# Altium project CSI2-NITROGEN_Rev01.PrjPcb
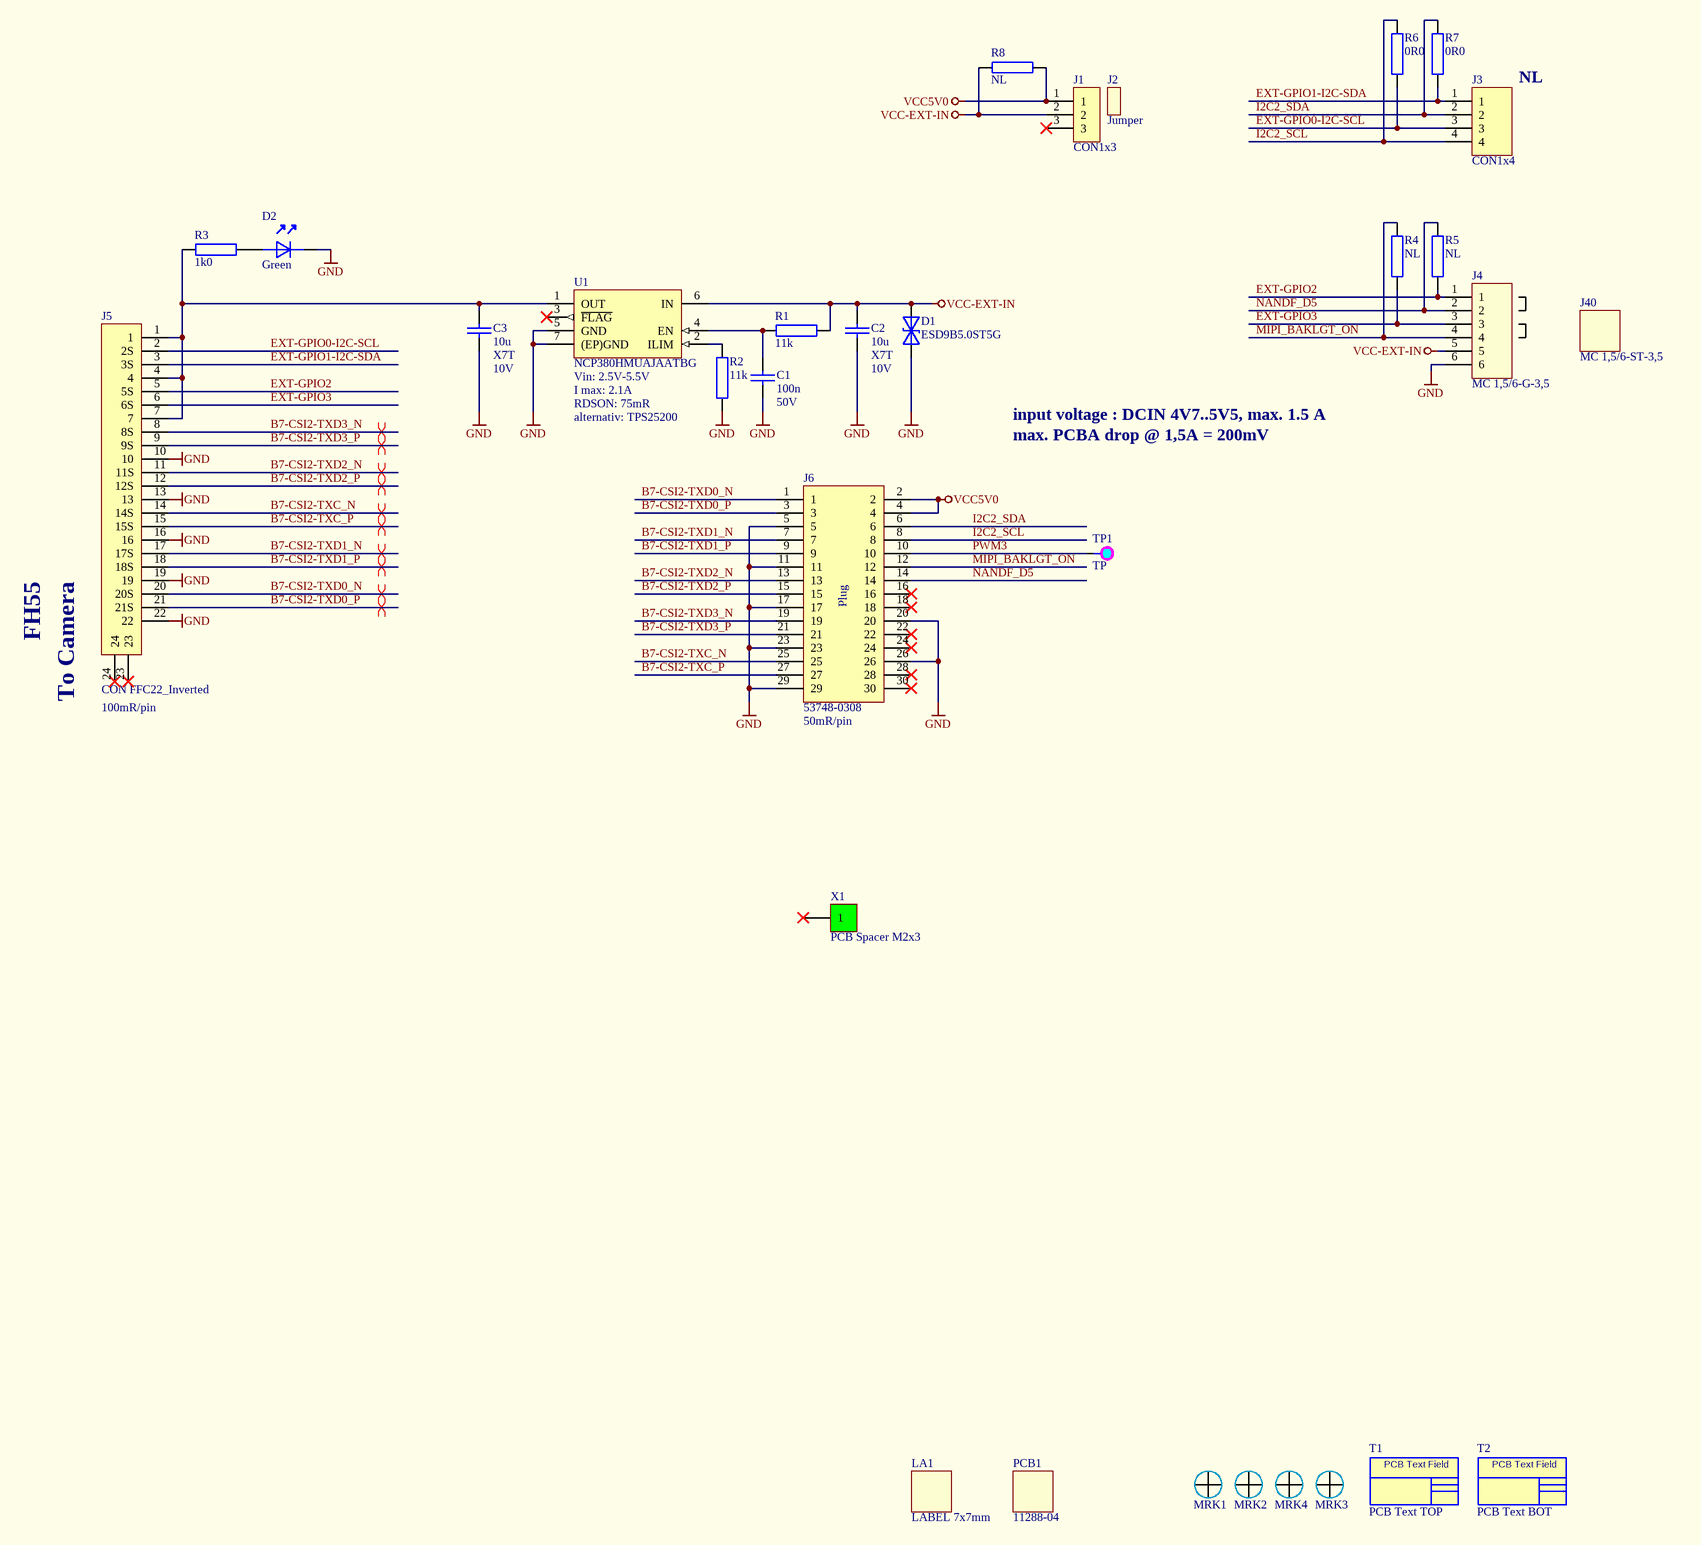
[diagram p0: CSI2-NITROGEN_Rev01.SchDoc]
VariantName: standard; Title: CSI2-NITROGEN_Rev01; RevisionPCB: 01; AuthorPCB: OFU; _ProjectName: CSI2-NITROGEN
1 sheet, 31 parts. Net scope: global (net labels, ports and power ports of the same name join across sheets).
Board file: CSI2-NITROGEN_Rev01.PcbDoc

## Sheet CSI2-NITROGEN_Rev01.SchDoc: CSI2-NITROGEN_Rev01
size A2; PageSetup: Record=PageOptions|CenterHorizontal=True|CenterVertical=True|PrintScale=0.73|XCorrection=1.00|YCorrection=1.00|PrintKind=2|BorderSize=5000000|LeftOffset=0|BottomOffset=0|Orientation=2|PaperLength=1000|PaperWidth=1000|Scale=100|PaperSource=7|PrintQuality=-4|MediaType=1|DitherType=10|PrintScaleMode=1|PaperKind=A3; CheckedBy: OFU; Author: CWA; CompanyName: Allied Vision Technologies GmbH; Address1: Taschenweg 2a; Address2: 07646 Stadtroda; Address3: Germany; Revision: 01; SheetNumber: 1; SheetTotal: 1

### Parts
C1  100n  Voltage: 50V  [C-0603_1.0]
C2  10u  Dielectric: X7T  Voltage: 10V  [C-0603_1.0]
C3  10u  Dielectric: X7T  Voltage: 10V  [C-0603_1.0]
D1  ESD9B5.0ST5G  [D-SOD923]
D2  Green  [D-0603-SLED]
J1  CON1x3  [CON 1x3 RM2.54]
J2  Jumper  [J-JUMPER-2.54]
J3  CON1x4  [CON 1x4 RM2.54]
J4  MC 1,5/6-G-3,5  [CON_MiniCon 6pol 3mm5]
J5  CON FFC22_Inverted  [J-FH55-22S-0.5SH - Inverted Pins]
J6  53748-0308  [J-MOLEX-53748-0308]
J40  MC 1,5/6-ST-3,5  (mechanical)
LA1  LABEL 7x7mm  [PCB LABEL 7x7]
MRK1  Marker Single Layer  [PCB_Marker_Pad_top]  (value not drawn)
MRK2  Marker Single Layer  [PCB_Marker_Pad_top]  (value not drawn)
MRK3  Marker Single Layer  [PCB_Marker_Pad_top]  (value not drawn)
MRK4  Marker Single Layer  [PCB_Marker_Pad_top]  (value not drawn)
PCB1  11288-04  (mechanical)
R1  11k  [R-0603_0.6]
R2  11k  [R-0603_0.6]
R3  1k0  [R-0603_0.6]
R4  NL  [R-0603_0.6]
R5  NL  [R-0603_0.6]
R6  0R0  [R-0603_0.6]
R7  0R0  [R-0603_0.6]
R8  NL  [R-0603_0.6]
T1  PCB Text TOP  [PCB TEXTFIELD TOP 2]  (no BOM)
T2  PCB Text BOT  [PCB TEXTFIELD BOT 2]  (no BOM)
TP1  TP  [TP_11_065]  (no BOM)
U1  NCP380HMUAJAATBG  Vin: 2.5V-5.5V  I max: 2.1A  [IC-DFN06_2.0x2.0x0.8]
X1  PCB Spacer M2x3  [X-HOLE-2.9-4.0-DK_AH_3.0]

### Nets
GND: C1.2 C2.2 C3.2 D1.A D2.K J4.6 J5.10 J5.13 J5.16 J5.19 J5.22 J6.5 J6.11 J6.17 J6.20 J6.23 J6.26 J6.29 R2.1 U1.5(GND) U1.7((EP)GND)
VCC5V0: J1.1 J6.2 J6.4 R8.1
VCC-EXT-IN: C2.1 D1.K J1.2 J4.5 R1.1 R8.2 U1.6(IN)
B7-CSI2-TXC_N: J5.14(14S) J6.25
B7-CSI2-TXC_P: J5.15(15S) J6.27
B7-CSI2-TXD0_N: J5.20(20S) J6.1
B7-CSI2-TXD0_P: J5.21(21S) J6.3
B7-CSI2-TXD1_N: J5.17(17S) J6.7
B7-CSI2-TXD1_P: J5.18(18S) J6.9
B7-CSI2-TXD2_N: J5.11(11S) J6.13
B7-CSI2-TXD2_P: J5.12(12S) J6.15
B7-CSI2-TXD3_N: J5.8(8S) J6.19
B7-CSI2-TXD3_P: J5.9(9S) J6.21
EXT-GPIO0-I2C-SCL: J3.3 J5.2(2S) R6.1
EXT-GPIO1-I2C-SDA: J3.1 J5.3(3S) R7.1
EXT-GPIO2: J4.1 J5.5(5S) R5.1
EXT-GPIO3: J4.3 J5.6(6S) R4.1
I2C2_SCL: J3.4 J6.8 R6.2
I2C2_SDA: J3.2 J6.6 R7.2
MIPI_BAKLGT_ON: J4.4 J6.12 R4.2
NANDF_D5: J4.2 J6.14 R5.2
PWM3: J6.10 TP1.1
NetC1_1: C1.1 R1.2 U1.4(EN)
NetC3_1: C3.1 J5.1 J5.4 J5.7 R3.1 U1.1(OUT)
NetD2_A: D2.A R3.2
NetR2_2: R2.2 U1.2(ILIM)

Not connected (* = marked no-connect by the designer): J1 3*; J5 23* 24*; J6 16* 18* 22* 24* 28* 30*; U1 3(~{FLAG})*; X1 1*

### Layout directives
differential pair: B7-CSI2-TXC_N, B7-CSI2-TXC_P, B7-CSI2-TXD0_N, B7-CSI2-TXD0_P, B7-CSI2-TXD1_N, B7-CSI2-TXD1_P, B7-CSI2-TXD2_N, B7-CSI2-TXD2_P, B7-CSI2-TXD3_N, B7-CSI2-TXD3_P

### Notes on the sheet
- (near J3) NL
- RDSON: 75mR
- (near R2) alternativ: TPS25200
- input voltage : DCIN 4V7..5V5, max. 1.5 A
- max. PCBA drop @ 1,5A = 200mV
- FH55
- (near J5) To Camera
- (near J5) 100mR/pin
- (near J6) 50mR/pin
- Author:
- Title:
- PCB:
- Checked by:
- PCBA:
- 2
- 3
- Confidential
- File:
- Date:
- Page:
- of
- No.
- 1
- Changes
- Rev.:
- Name:
- (in symbol CON Molex 53748-0308) Plug
- (in symbol PCB TEXT FIELD BOT) PCB Text Field
- (in symbol PCB TEXT FIELD TOP) PCB Text Field

### Library data of the parts
C1 = C 100N 50V X7R 0603: Capacitor Ceramic SMD/0603/50V/X7R/10%; KHK Part Number: K8340023; Manufacturer: several; Dielectric: X7R; Tolerance: 10%; Manufacturer Part Number: several
C2 C3 = C 10U 10V X7T 0603 125°C: Capacitor Ceramic SMD/0603/10V/X7T/20%/125°C; KHK Part Number: 10509; Manufacturer: several; Tolerance: 20%; Manufacturer Part Number: several
D1 = D ESD9B5.0ST5G: DIODE TVS; 400W; 5.8-7.8V; BIDIRECT; KHK Part Number: 7250; Manufacturer: ON Semiconductor; Manufacturer Part Number: ESD9B5.0ST5G
D2 = D Side LED 0603 green: Side LED 0603 20mA green; KHK Part Number: 4248; Manufacturer: several; Manufacturer Part Number: several; Color: green
J1 = CON 1x3 2.54: Stiftleiste; 1x3; 2.54mm; gerade; Manufacturer: fischer elektronik; Manufacturer Part Number: SL 11 124 3 G; KHK Part Number: K7600610
J2 = CON Jumper 2.54mm: CON/JUMPER/STC02SYAN; 2-pin; 2.54mm; 3A; FEMALE; VERTICAL; BLACK; KHK Part Number: 13444; Manufacturer: several; Manufacturer Part Number: several
J3 = CON 1x4 2.54: Stiftleiste; 1x4; 2.54mm; gerade; Manufacturer: Harwin; Manufacturer Part Number: M20-999 0445; KHK Part Number: K7600564
J4 = CON MiniCon 6pol 3mm5: Phoenix MC 1,5/6-G-3,5 MiniCon 6polig 3,5mm; KHK Part Number: K7600569; Manufacturer: Phoenix; Manufacturer Part Number: MC 1,5/6-G-3,5
J5 = CON FFC22_FH55-22S-0.5SH_Inverted: FFC Connector 0.5mm shielded; KHK Part Number: 10357; Manufacturer: Hirose; Manufacturer Part Number: FH55-22S-0.5SH
J6 = CON Molex 53748-0308: 30pin B2B plug 0.5 pitch 3mm Height; Manufacturer: Molex; KHK Part Number: 10287; Manufacturer Part Number: 53748-0308
J40 = CON MiniCon 6pol 3mm5 ST: Phoenix MC 1,5/6-ST-3,5 MiniCon 6polig 3,5mm; KHK Part Number: 1818; Manufacturer: Phoenix; Manufacturer Part Number: MC 1,5/6-ST-3,5
LA1 = PCB LABEL 7x7: Manufacturer: several; Manufacturer Part Number: several
MRK1-MRK4 = PCB Marker Pad Single Layer: Position Marker for PCBs
PCB1 = PCB: PCB ML04; Manufacturer: several; KHK Part Number: 11288-04; Manufacturer Part Number: 11288-04
R1 R2 = R 11K 1% 0603: Standard Resistor SMD/0603/1%/100mW/TK100; KHK Part Number: K8250147; Manufacturer: several; Tolerance: 1%; Temperature Coefficient: TK100; Manufacturer Part Number: several
R3 = R 1K0 1% 0603: Standard Resistor SMD/0603/1%/100mW/TK100; KHK Part Number: K8250040; Manufacturer: several; Tolerance: 1%; Temperature Coefficient: TK100; Manufacturer Part Number: several
R4 R5 R8 = R X 0603: Standard Resistor SMD/0603/1%/100mW/TK100; Temperature Coefficient: TK100; Tolerance: 1%
R6 R7 = R 0R0 1% 0603: Standard Resistor SMD/0603/1%/100mW/TK100; KHK Part Number: K8250041; Manufacturer: several; Tolerance: 1%; Manufacturer Part Number: several; Temperature Coefficient: *
T1 = PCB TEXT FIELD TOP: PCB Textfield TOP
T2 = PCB TEXT FIELD BOT: PCB Textfield BOT
TP1 = TP_11_065: Testpoint: Pad=1,1mm; Hole=0,65mm
U1 = IC  NCP380HMUAJAATBG: IC/PWR/LOADSW;1V2-5V5;3A;0R03/WLCSP6/1x1.5x0.63mm; KHK Part Number: 13676; Manufacturer: onsemi; Manufacturer Part Number: NCP380HMUAJAATBG
X1 = PCB Spacer M2x3: Abstandsbuchse SMTSO-2,1-3 ET; Manufacturer: KVT; KHK Part Number: 3291; Manufacturer Part Number: SMTSO-2,1-3 ET

## Assembly variants
standard: all parts fitted